# EAGLE schematic RespirationRevB (EAGLE 9.0.1)
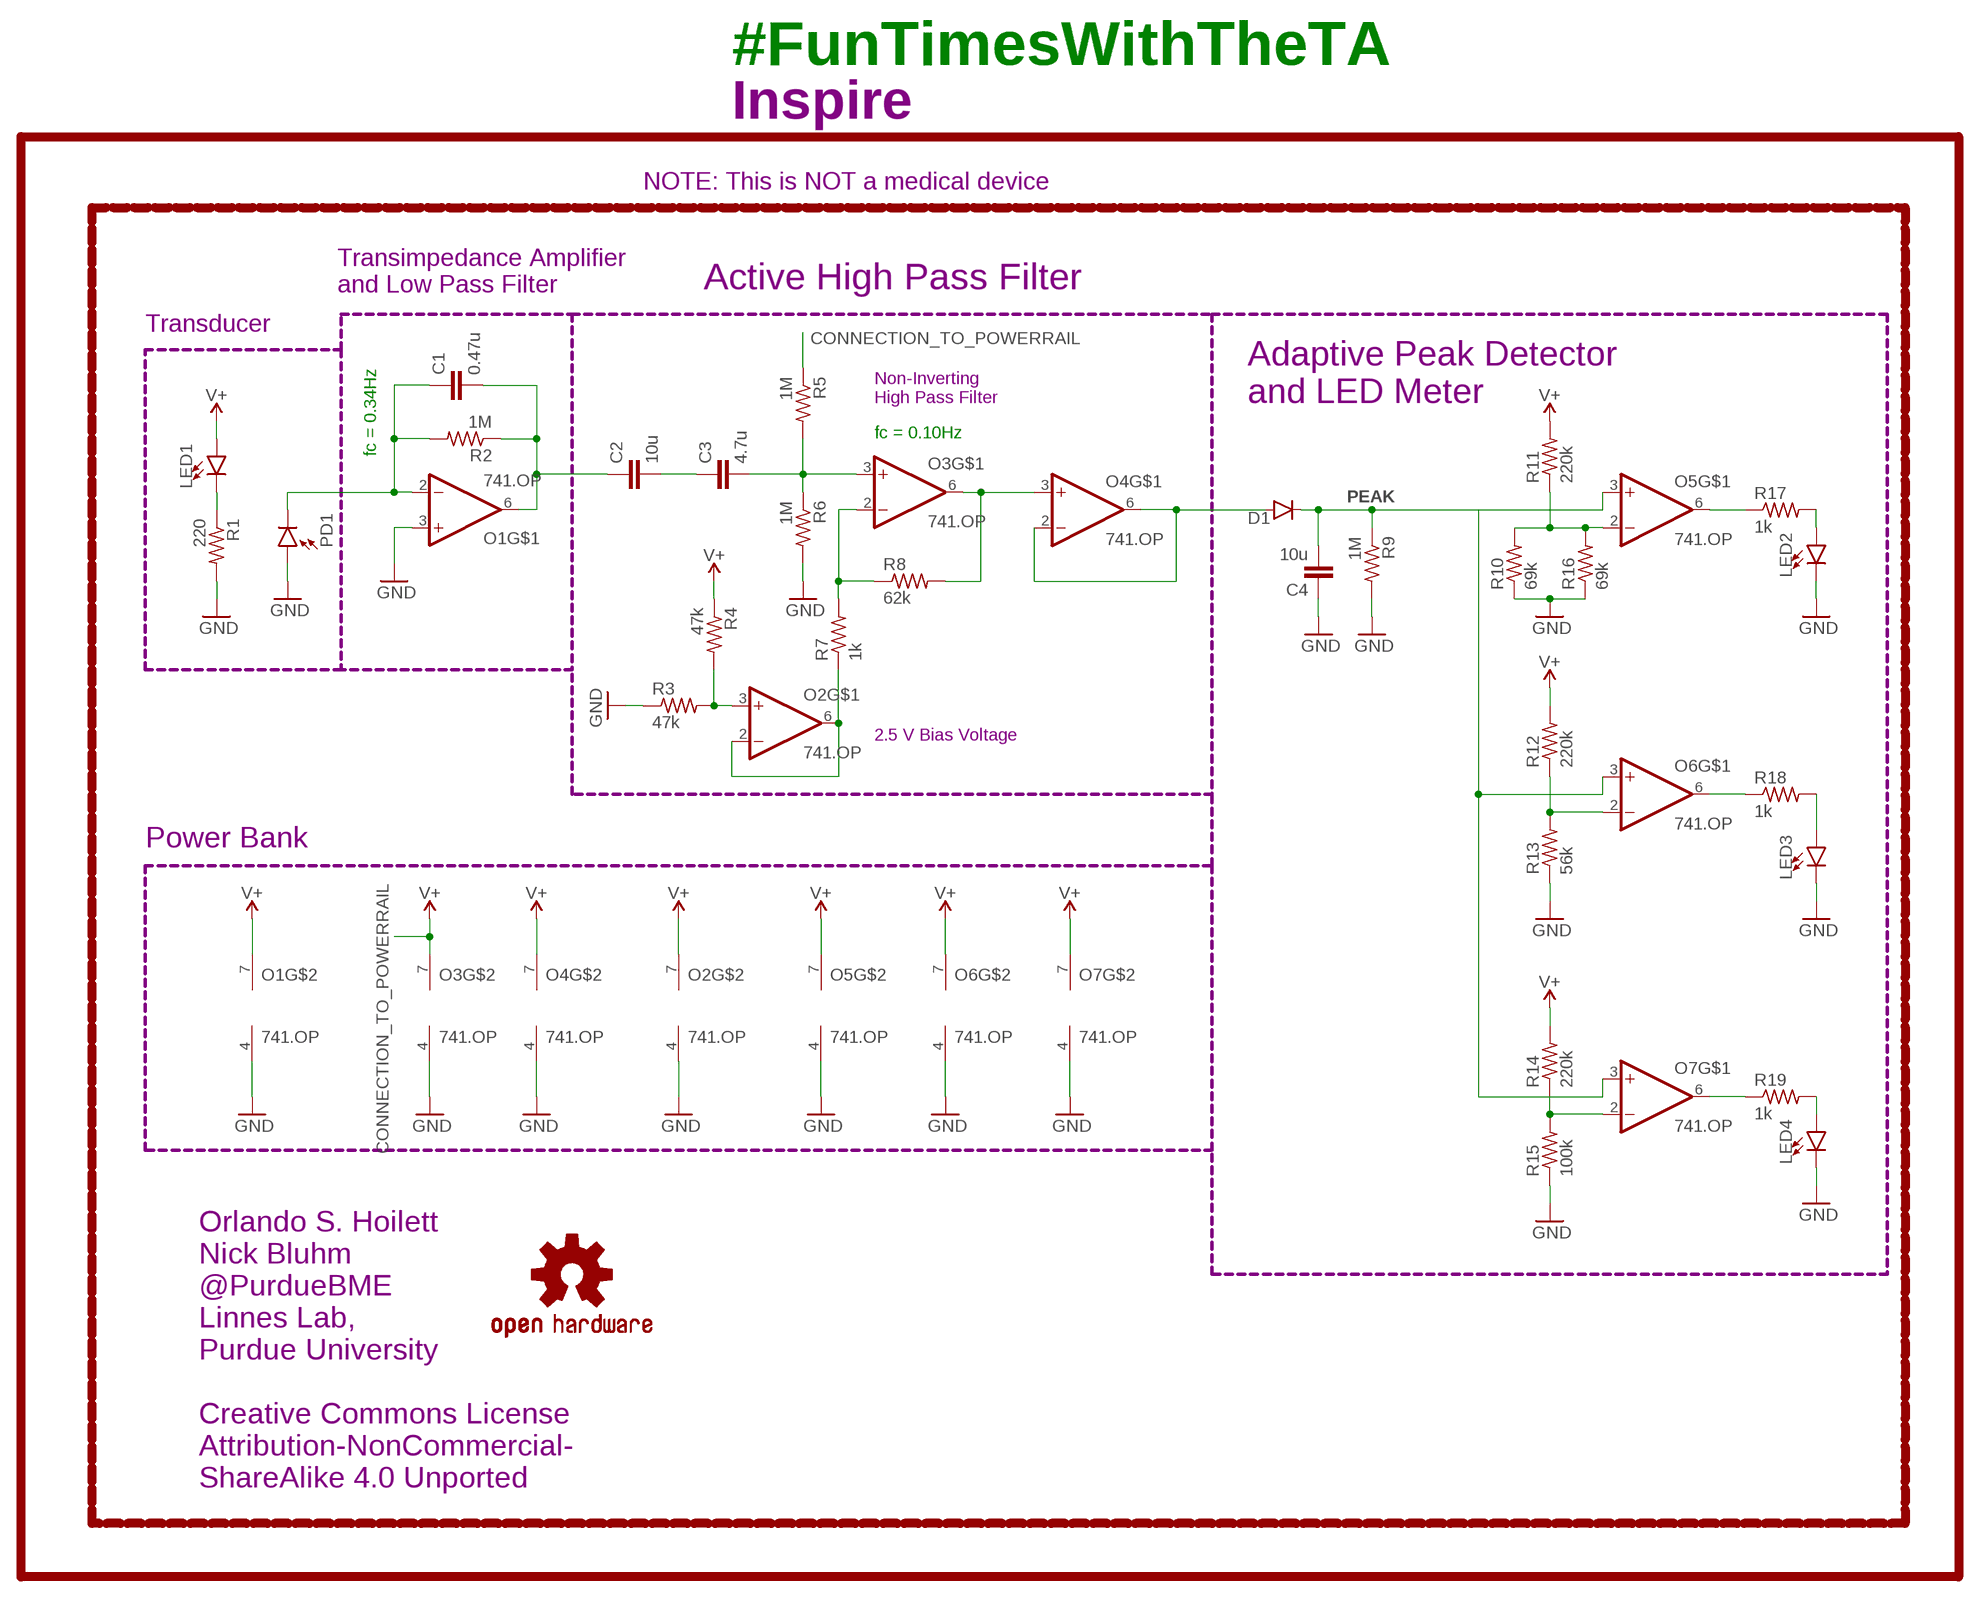
[diagram p0: schematic, sheet 1]

## Parts
C1  0.47u  C-EUC0402  [C0402]
C2  10u  C-EUC0402  [C0402]
C3  4.7u  C-EUC0402  [C0402]
C4  10u  C-EUC0805  [C0805]
D1  250mA/100V  DIODEBAS16  [SOD-323]
LED1  LED5MM  [LED_5MM]
LED2  LED5MM  [LED_5MM]
LED3  LED5MM  [LED_5MM]
LED4  LED5MM  [LED_5MM]
LOGO1  OSHW-LOGOS  [OSHW-LOGO-S]
O1  741.OP  [DIL08]
O2  741.OP  [DIL08]
O3  741.OP  [DIL08]
O4  741.OP  [DIL08]
O5  741.OP  [DIL08]
O6  741.OP  [DIL08]
O7  741.OP  [DIL08]
PD1  PHOTODIODE-5MM  [PD_5MM]
R1  220  R-US_R0402  [R0402]
R2  1M  R-US_R0402  [R0402]
R3  47k  R-US_R0402  [R0402]
R4  47k  R-US_R0402  [R0402]
R5  1M  R-US_R0402  [R0402]
R6  1M  R-US_R0402  [R0402]
R7  1k  R-US_R0402  [R0402]
R8  62k  R-US_R0402  [R0402]
R9  1M  R-US_R0402  [R0402]
R10  69k  R-US_R0402  [R0402]
R11  220k  R-US_R0402  [R0402]
R12  220k  R-US_R0402  [R0402]
R13  56k  R-US_R0402  [R0402]
R14  220k  R-US_R0402  [R0402]
R15  100k  R-US_R0402  [R0402]
R16  69k  R-US_R0402  [R0402]
R17  1k  R-US_R0402  [R0402]
R18  1k  R-US_R0402  [R0402]
R19  1k  R-US_R0402  [R0402]

## Nets
COMP: O5.6(OUT) R17.1
CONNECTION_TO_POWERRAIL: O3.7(V+) R5.1 ; supply symbol labelled V+
GND: C4.1 LED2.K(C) LED3.K(C) LED4.K(C) O1.3(+IN) O1.4(V-) O2.4(V-) O3.4(V-) O4.4(V-) O5.4(V-) O6.4(V-) O7.4(V-) PD1.A R1.2 R3.1 R6.2 R9.2 R10.1 R13.1 R15.1 R16.1
N$1: C1.1 O1.2(-IN) PD1.K(C) R2.2
N$2: C1.2 C2.1 O1.6(OUT) R2.1
N$3: C2.2 C3.1
N$4: C3.2 O3.3(+IN) R5.2 R6.1
N$5: O2.2(-IN) O2.6(OUT) R7.1
N$6: O2.3(+IN) R3.2 R4.2
N$7: LED2.A R17.2
N$8: O5.2(-IN) R10.2 R11.1 R16.2
N$9: LED1.K(C) R1.1
N$10: O3.2(-IN) R7.2 R8.1
N$11: LED3.A R18.2
N$12: O6.2(-IN) R12.1 R13.2
N$14: O6.6(OUT) R18.1
N$15: LED4.A R19.2
N$16: O7.6(OUT) R19.1
N$17: O7.2(-IN) R14.1 R15.2
PEAK: C4.2 D1.C O5.3(+IN) O6.3(+IN) O7.3(+IN) R9.1
PULSE: D1.A O3.6(OUT) O4.2(-IN) O4.3(+IN) O4.6(OUT) R8.2
V+: LED1.A O1.7(V+) O2.7(V+) O4.7(V+) O5.7(V+) O6.7(V+) O7.7(V+) R4.1 R11.2 R12.2 R14.2

## Notes on the sheet
- #FunTimesWithTheTA
- Inspire
- NOTE: This is NOT a medical device
- Active High Pass Filter
- Transimpedance Amplifier
  and Low Pass Filter
- Transducer
- Non-Inverting
  High Pass Filter
- Adaptive Peak Detector
  and LED Meter
- fc = 0.10Hz
- fc = 0.34Hz
- 2.5 V Bias Voltage
- Power Bank
- Orlando S. Hoilett
  Nick Bluhm
  @PurdueBME
  Linnes Lab,
  Purdue University
  
  Creative Commons License
  Attribution-NonCommercial-
  ShareAlike 4.0 Unported

## Library data of the parts
C1-C4 = resistor:C-EU: CAPACITOR, European symbol
D1 = SparkFun-DiscreteSemi:DIODE: Diode These are standard reverse protection diodes and small signal diodes. SMA package can handle up to about 1A. SOD-323 can handle about 200mA. What the SOD-323 package when ordering, there are some mfgs out there that are 5-pin packages.; PROD_ID: DIO-09646
LED1-LED4 = CalvEngIO-LED:LED: LED (Generic) Standard schematic elements and footprints for 5mm, 3mm, 1206, and 0603 sized LEDs. Generic LEDs with no color specified. LTST-C190KGKT: arrow indicates cathode
LOGO1 = SparkFun-Aesthetics:OSHW-LOGO: Open Source Hardware Logo This logo indicates the piece of hardware it is found on incorporates a OSHW license and/or adheres to the definition of open source hardware found here: http://freedomdefined.org/OSHW
O1-O7 = CalvEngIO-AnalogIC:741.OP
PD1 = CalvEngIO-Sensors:PHOTODIODE
R1-R19 = resistor:R-US_: RESISTOR, American symbol